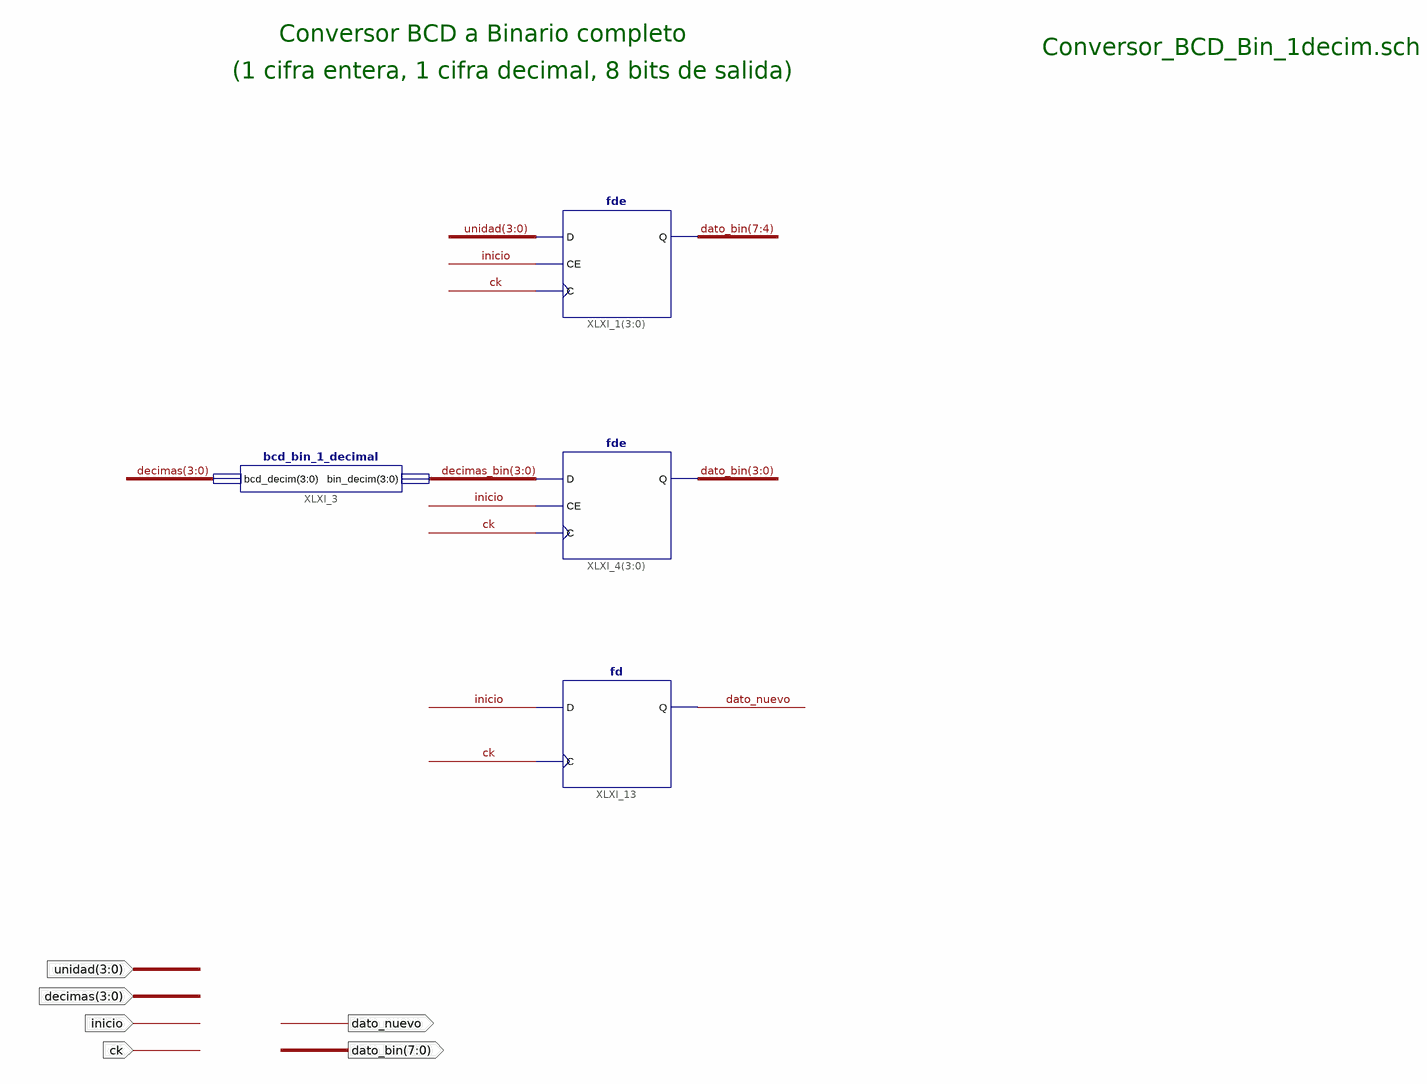
[diagram p0: schematic sheet 1]
// Xilinx ISE schematic Conversor_BCD_Bin_1decim.sch (spartan6) as structural Verilog: 4 symbols, 6 ports
module Conversor_BCD_Bin_1decim (
  input  [3:0] unidad,
  input  ck,
  input  [3:0] decimas,
  input  inicio,
  output [7:0] dato_bin,
  output dato_nuevo
);

  wire [3:0] decimas_bin;

  bcd_bin_1_decimal XLXI_3 (.bcd_decim(decimas), .bin_decim(decimas_bin));
  fde XLXI_4[3:0] (.C(ck), .CE(inicio), .D(decimas_bin), .Q(dato_bin[3:0]));
  fde XLXI_1[3:0] (.C(ck), .CE(inicio), .D(unidad), .Q(dato_bin[7:4]));
  fd XLXI_13 (.C(ck), .D(inicio), .Q(dato_nuevo));

  // Notes on the sheet:
  //   Conversor BCD a Binario completo
  //   Conversor_BCD_Bin_1decim.sch
  //   (1 cifra entera, 1 cifra decimal, 8 bits de salida)
endmodule
